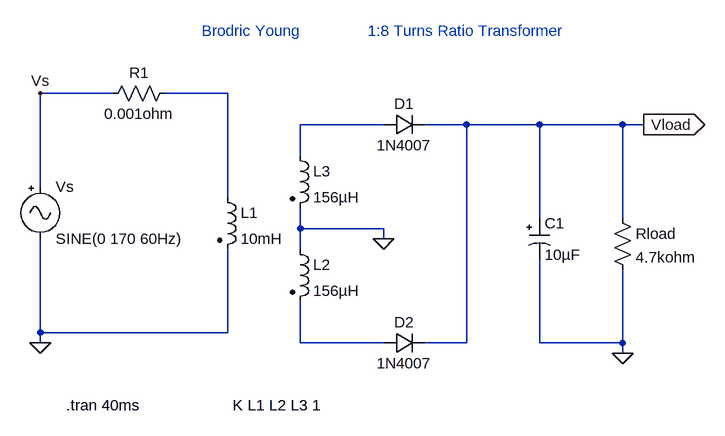
[diagram p0: schematic transformer_and_centerTapped_rectifier.asc]
transformer_and_centerTapped_rectifier.asc, the LTspice schematic file:
Version 4
SHEET 1 1116 680
WIRE 176 0 64 0
WIRE 352 0 256 0
WIRE 592 48 464 48
WIRE 720 48 656 48
WIRE 832 48 720 48
WIRE 960 48 832 48
WIRE 992 48 960 48
WIRE 464 96 464 48
WIRE 64 144 64 0
WIRE 352 160 352 0
WIRE 832 192 832 48
WIRE 960 192 960 48
WIRE 464 208 464 176
WIRE 592 208 464 208
WIRE 592 224 592 208
WIRE 464 240 464 208
WIRE 64 368 64 224
WIRE 352 368 352 240
WIRE 352 368 64 368
WIRE 64 384 64 368
WIRE 464 384 464 320
WIRE 592 384 464 384
WIRE 720 384 720 48
WIRE 720 384 656 384
WIRE 832 384 832 256
WIRE 960 384 960 272
WIRE 960 384 832 384
WIRE 960 400 960 384
FLAG 960 400 0
FLAG 592 224 0
FLAG 64 384 0
FLAG 992 48 Vload
IOPIN 992 48 Out
FLAG 64 0 Vs
SYMBOL Misc\\signal 64 128 R0
SYMATTR InstName Vs
SYMATTR Value SINE(0 170 60Hz)
SYMBOL res 272 -16 R90
WINDOW 0 0 56 VBottom 2
WINDOW 3 32 56 VTop 2
SYMATTR InstName R1
SYMATTR Value 0.001ohm
SYMBOL ind2 336 144 R0
SYMATTR InstName L1
SYMATTR Value 10mH
SYMATTR Type ind
SYMBOL ind2 448 224 R0
SYMATTR InstName L2
SYMATTR Value 156µH
SYMATTR Type ind
SYMBOL ind2 448 80 R0
SYMATTR InstName L3
SYMATTR Value 156µH
SYMATTR Type ind
SYMBOL diode 592 64 R270
WINDOW 0 32 32 VTop 2
WINDOW 3 0 32 VBottom 2
SYMATTR InstName D1
SYMATTR Value 1N4007
SYMBOL diode 592 400 R270
WINDOW 0 32 32 VTop 2
WINDOW 3 0 32 VBottom 2
SYMATTR InstName D2
SYMATTR Value 1N4007
SYMBOL polcap 816 192 R0
SYMATTR InstName C1
SYMATTR Value 10µF
SYMBOL res 944 176 R0
SYMATTR InstName Rload
SYMATTR Value 4.7kohm
TEXT 104 480 Left 2 !.tran 40ms
TEXT 360 480 Left 2 !K L1 L2 L3 1
TEXT 568 -96 Left 2 ;1:8 Turns Ratio Transformer
TEXT 312 -96 Left 2 ;Brodric Young

The netlist it stands for:
* transformer_and_centerTapped_rectifier.asc
Vs Vs 0 SINE(0 170 60Hz)
R1 N001 Vs 0.001ohm
L1 N001 0 10mH
L2 0 N003 156µH
L3 N002 0 156µH
D1 N002 Vload 1N4007
D2 N003 Vload 1N4007
C1 Vload 0 10µF
Rload Vload 0 4.7kohm
.model D D
.lib standard.dio
.tran 40ms
K L1 L2 L3 1
* 1:8 Turns Ratio Transformer
* Brodric Young
.backanno
.end